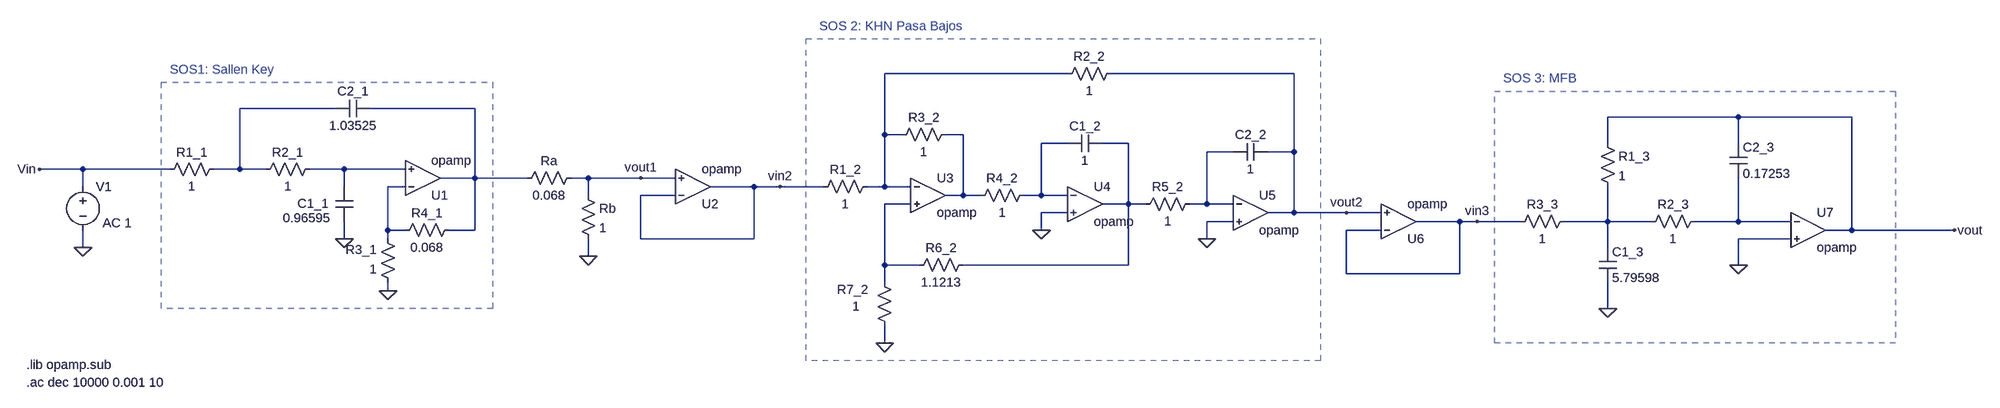
[diagram p0: schematic Ejercicio3_PasaBajos_Orden6.asc]
Ejercicio3_PasaBajos_Orden6.asc, the LTspice schematic file:
Version 4.1
SHEET 1 3316 680
WIRE 1280 0 944 0
WIRE 1696 0 1360 0
WIRE -64 64 -240 64
WIRE 192 64 0 64
WIRE 2512 80 2272 80
WIRE 2720 80 2512 80
WIRE 944 112 944 0
WIRE 976 112 944 112
WIRE 1088 112 1056 112
WIRE 1280 128 1232 128
WIRE 1392 128 1344 128
WIRE 2272 128 2272 80
WIRE 2512 128 2512 80
WIRE 1584 144 1536 144
WIRE 1696 144 1696 0
WIRE 1696 144 1648 144
WIRE -528 176 -608 176
WIRE -368 176 -528 176
WIRE -240 176 -240 64
WIRE -240 176 -288 176
WIRE -192 176 -240 176
WIRE -48 176 -112 176
WIRE 64 176 -48 176
WIRE 192 192 192 64
WIRE 192 192 128 192
WIRE 288 192 192 192
WIRE 400 192 368 192
WIRE 496 192 400 192
WIRE 560 192 496 192
WIRE -528 208 -528 176
WIRE -48 208 -48 176
WIRE 64 208 32 208
WIRE 704 208 624 208
WIRE 752 208 704 208
WIRE 832 208 752 208
WIRE 944 208 944 112
WIRE 944 208 912 208
WIRE 992 208 944 208
WIRE 400 224 400 192
WIRE 560 224 496 224
WIRE 1088 224 1088 112
WIRE 1088 224 1056 224
WIRE 1120 224 1088 224
WIRE 1232 224 1232 128
WIRE 1232 224 1200 224
WIRE 1280 224 1232 224
WIRE 992 240 944 240
WIRE 1392 240 1392 128
WIRE 1392 240 1344 240
WIRE 1424 240 1392 240
WIRE 1536 240 1536 144
WIRE 1536 240 1504 240
WIRE 1584 240 1536 240
WIRE 1280 256 1232 256
WIRE 1696 256 1696 144
WIRE 1696 256 1648 256
WIRE 1792 256 1696 256
WIRE 1856 256 1792 256
WIRE 1584 272 1536 272
WIRE 2000 272 1920 272
WIRE 2032 272 2000 272
WIRE 2112 272 2032 272
WIRE 2272 272 2272 208
WIRE 2272 272 2192 272
WIRE 2352 272 2272 272
WIRE 2512 272 2512 192
WIRE 2512 272 2432 272
WIRE 2608 272 2512 272
WIRE 32 288 32 208
WIRE 64 288 32 288
WIRE 192 288 192 192
WIRE 192 288 144 288
WIRE 1232 288 1232 256
WIRE 1856 288 1792 288
WIRE 2720 288 2720 80
WIRE 2720 288 2672 288
WIRE 2960 288 2720 288
WIRE -48 304 -48 272
WIRE 32 304 32 288
WIRE 496 304 496 224
WIRE 704 304 704 208
WIRE 704 304 496 304
WIRE 1536 304 1536 272
WIRE 2608 304 2512 304
WIRE -528 320 -528 288
WIRE 2272 320 2272 272
WIRE 400 336 400 304
WIRE 944 352 944 240
WIRE 1008 352 944 352
WIRE 1392 352 1392 240
WIRE 1392 352 1088 352
WIRE 2512 352 2512 304
WIRE 1792 368 1792 288
WIRE 2000 368 2000 272
WIRE 2000 368 1792 368
WIRE 944 384 944 352
WIRE 32 400 32 384
WIRE 2272 432 2272 384
WIRE 944 496 944 464
FLAG -48 304 0
FLAG -608 176 Vin
FLAG 1232 288 0
FLAG 1536 304 0
FLAG 944 496 0
FLAG 2272 432 0
FLAG 2512 352 0
FLAG -528 320 0
FLAG 32 400 0
FLAG 400 336 0
FLAG 496 192 vout1
FLAG 752 208 vin2
FLAG 1792 256 vout2
FLAG 2032 272 vin3
FLAG 2960 288 vout
SYMBOL res -272 160 R90
WINDOW 0 0 56 VBottom 2
WINDOW 3 32 56 VTop 2
SYMATTR InstName R1_1
SYMATTR Value 1
SYMBOL res -96 160 R90
WINDOW 0 0 56 VBottom 2
WINDOW 3 32 56 VTop 2
SYMATTR InstName R2_1
SYMATTR Value 1
SYMBOL cap -64 208 R0
WINDOW 0 -70 31 Left 2
WINDOW 3 -97 58 Left 2
SYMATTR InstName C1_1
SYMATTR Value 0.96595
SYMBOL cap 0 48 R90
WINDOW 0 0 32 VBottom 2
WINDOW 3 32 32 VTop 2
SYMATTR InstName C2_1
SYMATTR Value 1.03525
SYMBOL OpAmps\\opamp 96 256 M180
SYMATTR InstName U1
SYMBOL OpAmps\\opamp 592 272 M180
SYMATTR InstName U2
SYMBOL res 928 192 R90
WINDOW 0 0 56 VBottom 2
WINDOW 3 32 56 VTop 2
SYMATTR InstName R1_2
SYMATTR Value 1
SYMBOL res 1264 16 R270
WINDOW 0 32 56 VTop 2
WINDOW 3 0 56 VBottom 2
SYMATTR InstName R2_2
SYMATTR Value 1
SYMBOL res 960 128 R270
WINDOW 0 32 56 VTop 2
WINDOW 3 0 56 VBottom 2
SYMATTR InstName R3_2
SYMATTR Value 1
SYMBOL res 1104 240 R270
WINDOW 0 32 56 VTop 2
WINDOW 3 0 56 VBottom 2
SYMATTR InstName R4_2
SYMATTR Value 1
SYMBOL res 1408 256 R270
WINDOW 0 32 56 VTop 2
WINDOW 3 0 56 VBottom 2
SYMATTR InstName R5_2
SYMATTR Value 1
SYMBOL res 992 368 R270
WINDOW 0 32 56 VTop 2
WINDOW 3 0 56 VBottom 2
SYMATTR InstName R6_2
SYMATTR Value 1.1213
SYMBOL res 928 368 R0
WINDOW 0 -71 29 Left 2
WINDOW 3 -43 60 Left 2
SYMATTR InstName R7_2
SYMATTR Value 1
SYMBOL cap 1344 112 R90
WINDOW 0 0 32 VBottom 2
WINDOW 3 32 32 VTop 2
SYMATTR InstName C1_2
SYMATTR Value 1
SYMBOL cap 1648 128 R90
WINDOW 0 0 32 VBottom 2
WINDOW 3 32 32 VTop 2
SYMATTR InstName C2_2
SYMATTR Value 1
SYMBOL OpAmps\\opamp 1024 160 R0
SYMATTR InstName U3
SYMBOL OpAmps\\opamp 1312 176 R0
SYMATTR InstName U4
SYMBOL OpAmps\\opamp 1616 192 R0
SYMATTR InstName U5
SYMBOL OpAmps\\opamp 1888 336 M180
SYMATTR InstName U6
SYMBOL res 2256 112 R0
SYMATTR InstName R1_3
SYMATTR Value 1
SYMBOL res 2448 256 R90
WINDOW 0 0 56 VBottom 2
WINDOW 3 32 56 VTop 2
SYMATTR InstName R2_3
SYMATTR Value 1
SYMBOL res 2208 256 R90
WINDOW 0 0 56 VBottom 2
WINDOW 3 32 56 VTop 2
SYMATTR InstName R3_3
SYMATTR Value 1
SYMBOL cap 2256 320 R0
SYMATTR InstName C1_3
SYMATTR Value 5.79598
SYMBOL cap 2496 128 R0
SYMATTR InstName C2_3
SYMATTR Value 0.17253
SYMBOL OpAmps\\opamp 2640 224 R0
SYMATTR InstName U7
SYMBOL voltage -528 192 R0
WINDOW 123 36 83 Left 2
WINDOW 39 0 0 Left 0
SYMATTR Value2 AC 1
SYMATTR InstName V1
SYMATTR Value ""
SYMBOL res 160 272 R90
WINDOW 0 0 56 VBottom 2
WINDOW 3 32 56 VTop 2
SYMATTR InstName R4_1
SYMATTR Value 0.068
SYMBOL res 48 400 R180
WINDOW 0 36 76 Left 2
WINDOW 3 36 40 Left 2
SYMATTR InstName R3_1
SYMATTR Value 1
SYMBOL res 384 208 R0
SYMATTR InstName Rb
SYMATTR Value 1
SYMBOL res 384 176 R90
WINDOW 0 0 56 VBottom 2
WINDOW 3 32 56 VTop 2
SYMATTR InstName Ra
SYMATTR Value 0.068
TEXT -632 536 Left 2 !.lib opamp.sub
TEXT -368 -8 Left 2 ;SOS1: Sallen Key
TEXT 824 -88 Left 2 ;SOS 2: KHN Pasa Bajos
TEXT 2080 8 Left 2 ;SOS 3: MFB
TEXT -632 568 Left 2 !.ac dec 10000 0.001 10
RECTANGLE Normal 1744 528 800 -64 2
RECTANGLE Normal 2800 496 2064 32 2
RECTANGLE Normal 224 432 -384 16 2

The netlist it stands for:
* Ejercicio3_PasaBajos_Orden6.asc
R1_1 N002 Vin 1
R2_1 N008 N002 1
C1_1 N008 0 0.96595
C2_1 N003 N002 1.03525
X§U1 N009 N008 N003 opamp Aol=100K GBW=10Meg  ; pins invin noninvin out
X§U2 vin2 vout1 vin2 opamp Aol=100K GBW=10Meg  ; pins invin noninvin out
R1_2 N001 vin2 1
R2_2 N001 vout2 1
R3_2 N001 N004 1
R4_2 N004 N005 1
R5_2 N006 N007 1
R6_2 N010 N006 1.1213
R7_2 N010 0 1
C1_2 N006 N005 1
C2_2 vout2 N007 1
X§U3 N001 N010 N004 opamp Aol=100K GBW=10Meg  ; pins invin noninvin out
X§U4 N005 0 N006 opamp Aol=100K GBW=10Meg  ; pins invin noninvin out
X§U5 N007 0 vout2 opamp Aol=100K GBW=10Meg  ; pins invin noninvin out
X§U6 vin3 vout2 vin3 opamp Aol=100K GBW=10Meg  ; pins invin noninvin out
R1_3 vout N011 1
R2_3 N012 N011 1
R3_3 N011 vin3 1
C1_3 N011 0 5.79598
C2_3 vout N012 0.17253
X§U7 N012 0 vout opamp Aol=100K GBW=10Meg  ; pins invin noninvin out
V1 Vin 0 AC 1
R4_1 N003 N009 0.068
R3_1 0 N009 1
Rb vout1 0 1
Ra vout1 N003 0.068
.lib opamp.sub
* SOS1: Sallen Key
* SOS 2: KHN Pasa Bajos
* SOS 3: MFB
.ac dec 10000 0.001 10
.backanno
.end